# Altium schematic sheet Converter.SchDoc: Converter
size A3; DocumentNumber: 4; SheetNumber: 4; SheetTotal: 20
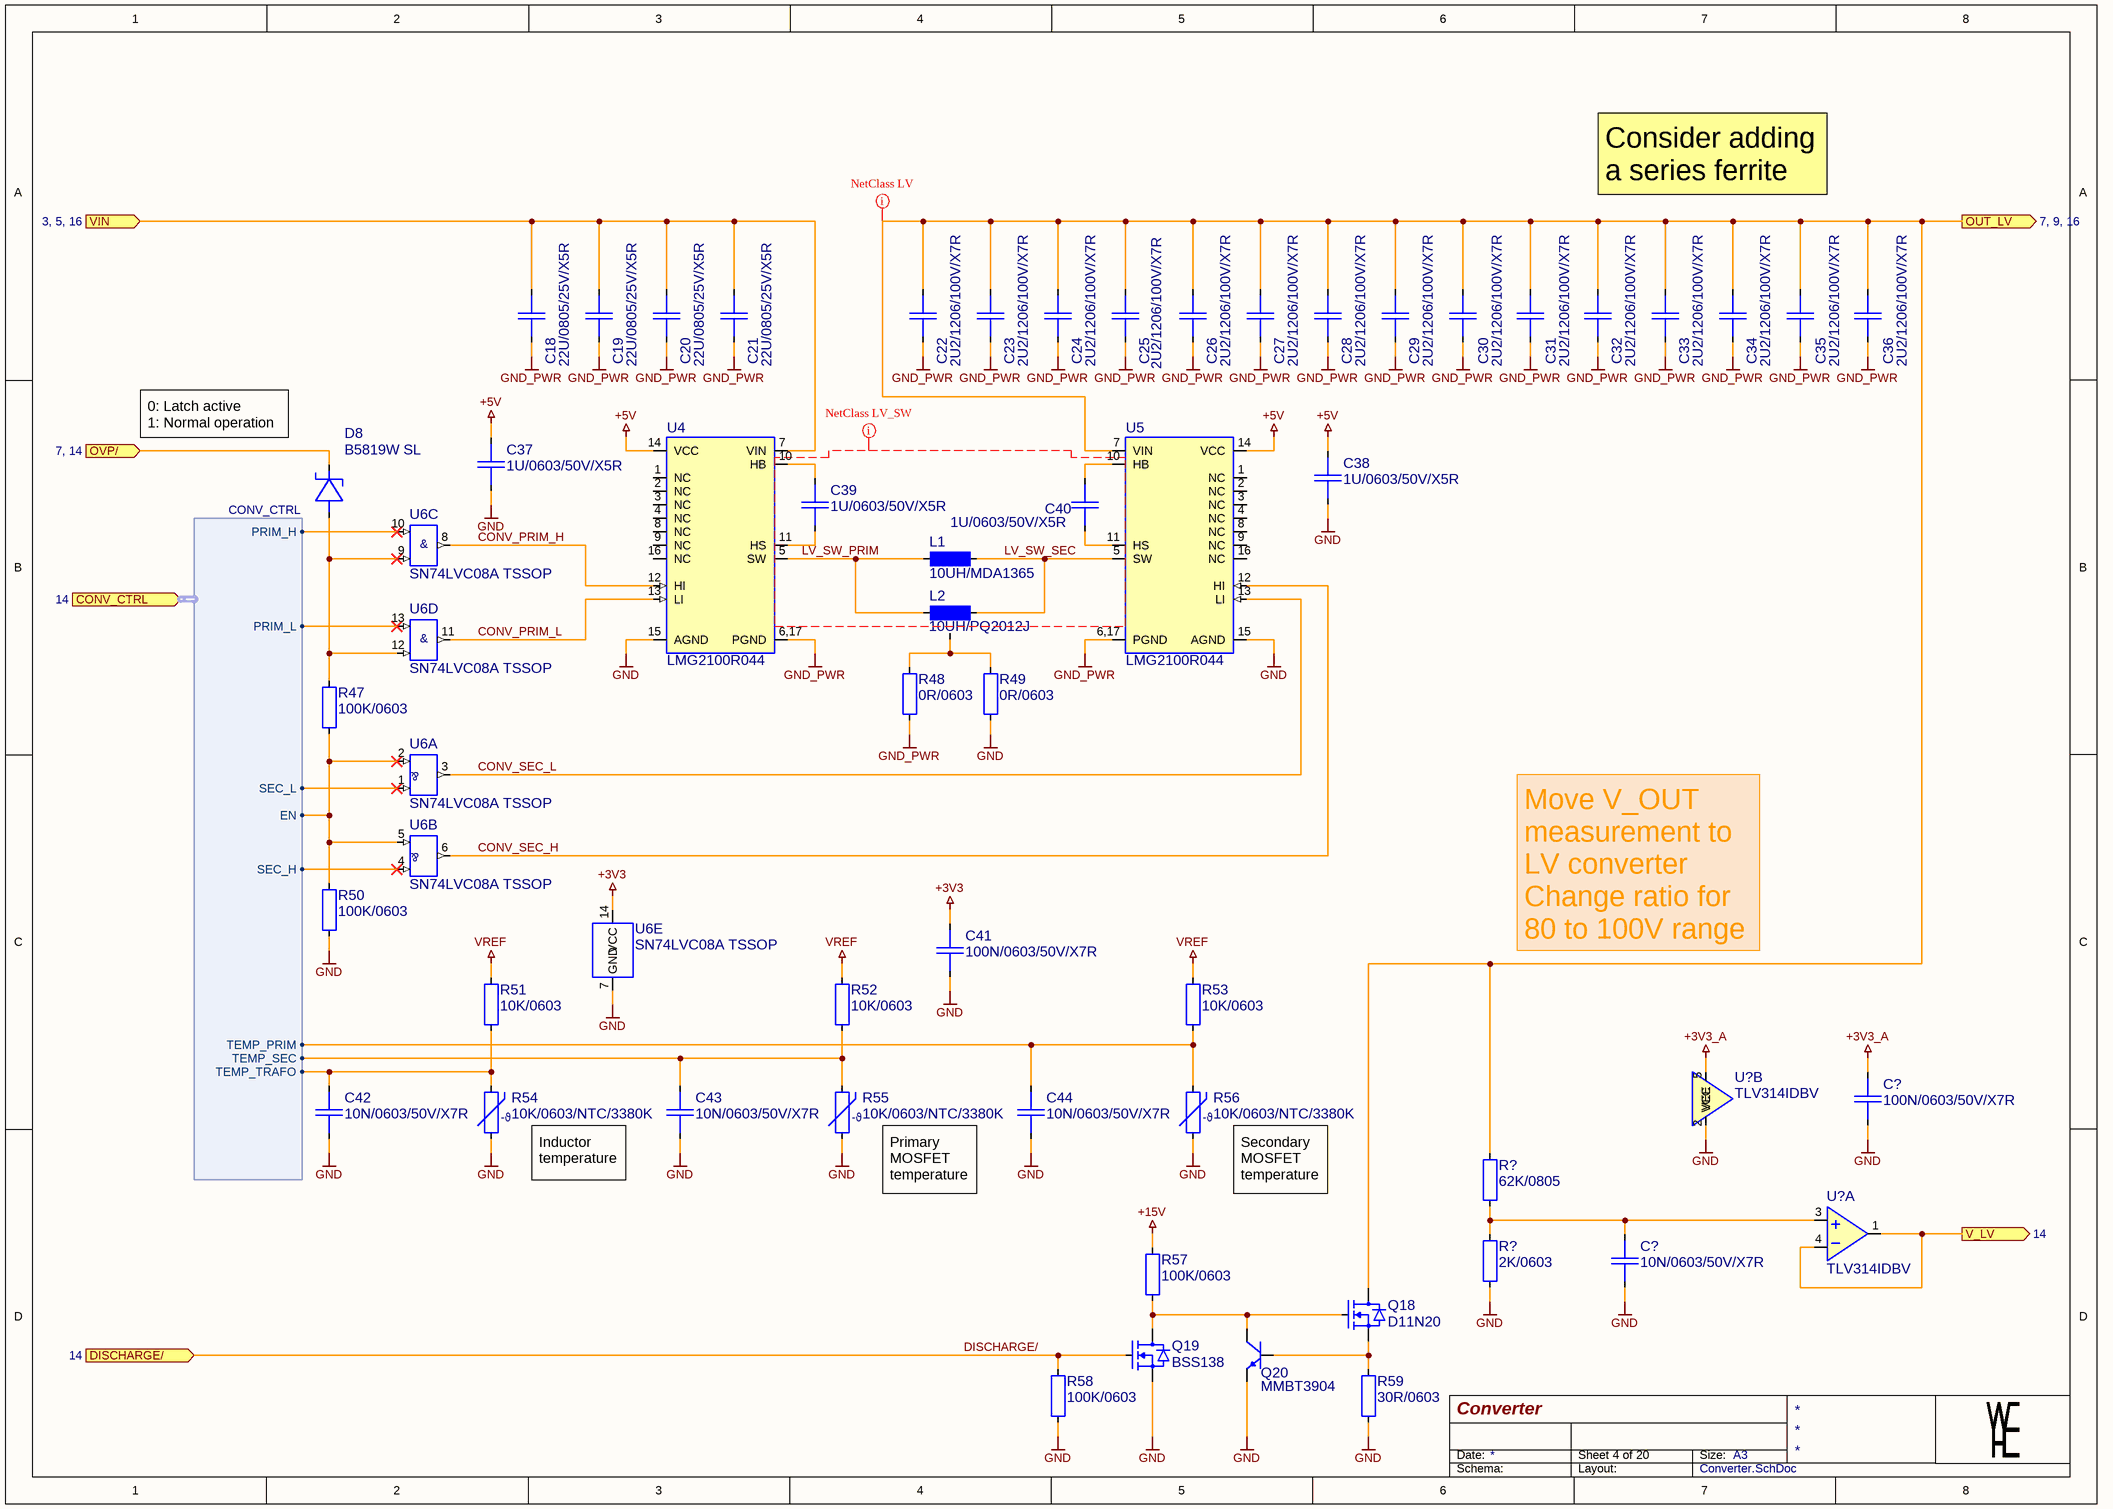
[diagram p0: Converter.SchDoc]

## Parts
(Parts that share a designator on the sheet are numbered #1, #2 ... from top to bottom, then left to right.)
C18  22U/0805/25V/X5R  [CAP0805_X7R]
C19  22U/0805/25V/X5R  [CAP0805_X7R]
C20  22U/0805/25V/X5R  [CAP0805_X7R]
C21  22U/0805/25V/X5R  [CAP0805_X7R]
C22  2U2/1206/100V/X7R  [CAP1206-X7R]
C23  2U2/1206/100V/X7R  [CAP1206-X7R]
C24  2U2/1206/100V/X7R  [CAP1206-X7R]
C25  2U2/1206/100V/X7R  [CAP1206-X7R]
C26  2U2/1206/100V/X7R  [CAP1206-X7R]
C27  2U2/1206/100V/X7R  [CAP1206-X7R]
C28  2U2/1206/100V/X7R  [CAP1206-X7R]
C29  2U2/1206/100V/X7R  [CAP1206-X7R]
C30  2U2/1206/100V/X7R  [CAP1206-X7R]
C31  2U2/1206/100V/X7R  [CAP1206-X7R]
C32  2U2/1206/100V/X7R  [CAP1206-X7R]
C33  2U2/1206/100V/X7R  [CAP1206-X7R]
C34  2U2/1206/100V/X7R  [CAP1206-X7R]
C35  2U2/1206/100V/X7R  [CAP1206-X7R]
C36  2U2/1206/100V/X7R  [CAP1206-X7R]
C37  1U/0603/50V/X5R  [CAP0603_X7R]
C38  1U/0603/50V/X5R  [CAP0603_X7R]
C39  1U/0603/50V/X5R  [CAP0603_X7R]
C40  1U/0603/50V/X5R  [CAP0603_X7R]
C41  100N/0603/50V/X7R  [CAP0603_X7R]
C42  10N/0603/50V/X7R  [CAP0603_X7R]
C43  10N/0603/50V/X7R  [CAP0603_X7R]
C44  10N/0603/50V/X7R  [CAP0603_X7R]
C?#1  100N/0603/50V/X7R  [CAP0603_X7R]
C?#2  10N/0603/50V/X7R  [CAP0603_X7R]
D8  B5819W SL  [SOD3718X125]
L1  10UH/MDA1365  [INDM140X128X65]
L2  10UH/PQ2012J  [IND_PQ2015J]
Q18  D11N20  [TO228P990X229-3]
Q19  BSS138  [SOT2395P280X125-3-SE]
Q20  MMBT3904  [SOT2395P280X125-3-SE]
R47  100K/0603  [R0603-0.40-WW]
R48  0R/0603  [R0603-0.40-WW]
R49  0R/0603  [R0603-0.40-WW]
R50  100K/0603  [R0603-0.40-WW]
R51  10K/0603  [R0603-0.40-WW]
R52  10K/0603  [R0603-0.40-WW]
R53  10K/0603  [R0603-0.40-WW]
R54  10K/0603/NTC/3380K  [R0603-0.40-WW]
R55  10K/0603/NTC/3380K  [R0603-0.40-WW]
R56  10K/0603/NTC/3380K  [R0603-0.40-WW]
R57  100K/0603  [R0603-0.40-WW]
R58  100K/0603  [R0603-0.40-WW]
R59  30R/0603  [R0603-0.40-WW]
R?#1  62K/0805  [R0805-0.50-WW]
R?#2  2K/0603  [R0603-0.40-WW]
U4  LMG2100R044  [QFN050P450X550X085-16-TI-VQFN-FCRLF]
U5  LMG2100R044  [QFN050P450X550X085-16-TI-VQFN-FCRLF]
U6  SN74LVC08A TSSOP  [SOP065P640X120-14NW]  (parts A,B,C,D,E of 5)
U?#1  TLV314IDBV  [SOT2395P280X125-5-NW]  (part B of 2)
U?#2  TLV314IDBV  [SOT2395P280X125-5-NW]  (part A of 2)

## Ports
CONV_CTRL (in, harness CONV_CTRL, see 14), DISCHARGE/ (in, see 14), OUT_LV (out, see 7, 9, 16), OVP/ (in, see 7, 14), V_LV (out, see 14), VIN (in, see 3, 5, 16)

## Harnesses
CONV_CTRL: EN, PRIM_L, SEC_L, PRIM_H, TEMP_PRIM, TEMP_SEC, TEMP_TRAFO, SEC_H

## Nets
+3V3: C41.1 U6.14(VCC)
+3V3_A: C?#1.1 U?#1.5(VCC)
+5V: C37.1 C38.1 U4.14(VCC) U5.14(VCC)
+15V: R57.1
GND: C37.2 C38.2 C41.2 C42.2 C43.2 C44.2 C?#1.2 C?#2.2 Q19.2(SOURCE) Q20.2(EMITTER) R49.2 R50.2 R54.2 R55.2 R56.2 R58.2 R59.2 R?#2.2 U4.15(AGND) U5.15(AGND) U6.7(GND) U?#1.2(VEE)
GND_PWR: C18.2 C19.2 C20.2 C21.2 C22.2 C23.2 C24.2 C25.2 C26.2 C27.2 C28.2 C29.2 C30.2 C31.2 C32.2 C33.2 C34.2 C35.2 C36.2 R48.2 U4.6,17(PGND) U5.6,17(PGND)
VREF: R51.1 R52.1 R53.1
CONV_PRIM_H: U4.12(HI) U6.8(Y2)
CONV_PRIM_L: U4.13(LI) U6.11(Y3)
CONV_SEC_H: U5.12(HI) U6.6(Y1)
CONV_SEC_L: U5.13(LI) U6.3(Y0)
DISCHARGE/: Q19.1(GATE) R58.1 ; port DISCHARGE/
LV_SW_PRIM: L1.1 L2.1 U4.5(SW)
LV_SW_SEC: L1.2 L2.2 U5.5(SW)
OUT_LV: C22.1 C23.1 C24.1 C25.1 C26.1 C27.1 C28.1 C29.1 C30.1 C31.1 C32.1 C33.1 C34.1 C35.1 C36.1 Q18.3(DRAIN) R?#1.1 U5.7(VIN) ; port OUT_LV
OVP/: D8.1(C) ; port OVP/
V_LV: U?#2.1(OUT) U?#2.4(IN-) ; port V_LV
VIN: C18.1 C19.1 C20.1 C21.1 U4.7(VIN) ; port VIN
NetC39_1: C39.1 U4.10(HB)
NetC39_2: C39.2 U4.11(HS)
NetC40_1: C40.1 U5.10(HB)
NetC40_2: C40.2 U5.11(HS)
NetC42_1: C42.1 R51.2 R54.1 ; port CONV_CTRL.TEMP_TRAFO
NetC43_1: C43.1 R52.2 R55.1 ; port CONV_CTRL.TEMP_SEC
NetC44_1: C44.1 R53.2 R56.1 ; port CONV_CTRL.TEMP_PRIM
NetC?#2_1: C?#2.1 R?#1.2 R?#2.1 U?#2.3(IN+)
NetD8_2: D8.2(A) R47.2 U6.9(B2) U6.12(B3)
NetL2_3: L2.3 R48.1 R49.1
NetQ18_1: Q18.1(GATE) Q19.3(DRAIN) Q20.3(COLLECTOR) R57.2
NetQ18_2: Q18.2(SOURCE) Q20.1(BASE) R59.1
NetR47_1: R47.1 R50.1 U6.2(B0) U6.5(B1) ; port CONV_CTRL.EN
NetU6_1: U6.1(A0) ; port CONV_CTRL.SEC_L
NetU6_4: U6.4(A1) ; port CONV_CTRL.SEC_H
NetU6_10: U6.10(A2) ; port CONV_CTRL.PRIM_H
NetU6_13: U6.13(A3) ; port CONV_CTRL.PRIM_L

Not connected (* = marked no-connect by the designer): U4 1(NC) 2(NC) 3(NC) 4(NC) 8(NC) 9(NC) 16(NC); U5 1(NC) 2(NC) 3(NC) 4(NC) 8(NC) 9(NC) 16(NC)

## Layout directives
net class LV: OUT_LV
net class LV_SW: LV_SW_PRIM, LV_SW_SEC

## Notes on the sheet
- Consider adding a series ferrite
- (near D8) 0: Latch active
  1: Normal operation
- Move V_OUT measurement to LV converter
  Change ratio for 80 to 100V range
- Inductor temperature
- Primary MOSFET temperature
- (near R56) Secondary MOSFET temperature
- (near R56) Alternative:
  G830K (C22362804)
- Date:
- Size:
- A3
- Schema:
- Layout:
- (in symbol 10K/0603/NTC/3380K) -ϑ
- (in symbol SN74LVC08A TSSOP, part A) &
- (in symbol SN74LVC08A TSSOP, part B) &
- (in symbol SN74LVC08A TSSOP, part C) &
- (in symbol SN74LVC08A TSSOP, part D) &

## Library data of the parts
C18-C21 = 22U/0805/25V/X5R: CAP SM 0805 22uF 25V X5R; Manufacturer: GENERIC; Manufacturer 1: Samsung Electro-Mechanics; Manufacturer Part Number 1: CL21A226MAYNNNE; Absolute Value: 2.2E-5; Eurocircuits GPN: GPN0805106-25; Part Number: 22U/0805/25V/X5R; Package: 0805; Value: 22uF; HelpURL: https://mm.digikey.com/Volume0/opasdata/d220001/medias/docus/339/CL21A226MAYNNNE_Spec.pdf; Supplier 1: Digi-Key; Supplier Part Number 1: 1276-CL21A226MAYNNNECT-ND; Manufacturer Part Number 3: CL21A226MAQNNNE; Supplier 3: LCSC; Supplier Part Number 3: C45783; JLC Type: Basic
C22-C36 = 2U2/1206/100V/X7R: CAP SM 1206 2.2uF 100V X7R; Manufacturer: GENERIC; Manufacturer 1: YAGEO; Manufacturer Part Number 1: CC1206KKX7R0BB225; Absolute Value: 2.2E-6; Part Number: 2U2/1206/100V/X7R; Package: 1206; Value: 2.2uF; HelpURL: https://www.yageogroup.com/content/datasheet/asset/file/UPY-GPHC_X7R_6_3V-TO-250V; Supplier 1: Digi-Key; Supplier Part Number 1: 311-3450-1-ND; Manufacturer Part Number 3: CC1206KKX7R0BB225; Supplier 3: LCSC; Supplier Part Number 3: C577211; JLC Type: Extended
C37-C40 = 1U/0603/50V/X5R: CAP SM 0603 1.0uF 50V X5R; Manufacturer: GENERIC; Manufacturer 1: Samsung Electro-Mechanics; Manufacturer Part Number 1: CL10A105KB8NNNC; Absolute Value: 1E-6; Eurocircuits GPN: GPC0603105-X5R; Part Number: 1U/0603/50V/X5R; Package: 0603; Value: 1.0uF; HelpURL: https://mm.digikey.com/Volume0/opasdata/d220001/medias/docus/658/CL10A105KB8NNNC_Spec.pdf; Supplier 1: Digi-Key; Supplier Part Number 1: 1276-1860-1-ND; Supplier 3: LCSC; Supplier Part Number 3: C15849; JLC Type: Basic; Manufacturer Part Number 3: CL10A105KB8NNNC
C41 C?#1 = 100N/0603/50V/X7R: CAP SM 0603 100nF 50V X7R; Manufacturer: GENERIC; Manufacturer 1: YAGEO; Manufacturer Part Number 1: CC0603KPX7R9BB104; Absolute Value: 1E-7; Eurocircuits GPN: GPC0603104; Part Number: 100N/0603/50V/X7R; Package: 0603; Value: 100nF; HelpURL: https://www.yageo.com/upload/media/product/app/datasheet/mlcc/upy-gphc_x7r_6_3v-to-250v.pdf; Supplier 1: Digi-Key; Supplier Part Number 1: 311-3567-1-ND; Supplier 3: LCSC; Supplier Part Number 3: C14663; Manufacturer 2: YAGEO; Manufacturer Part Number 2: CC0603MRX7R9BB104; Supplier 2: Digi-Key; Supplier Part Number 2: 311-4110-1-ND; JLC Type: Basic; Manufacturer Part Number 3: CC0603KRX7R9BB104
C42-C44 C?#2 = 10N/0603/50V/X7R: CAP SM 0603 10nF 50V X7R; Manufacturer: GENERIC; Manufacturer 1: YAGEO; Manufacturer Part Number 1: CC0603KPX7R9BB103; Absolute Value: 1E-8; Eurocircuits GPN: GPC0603103; Part Number: 10N/0603/50V/X7R; Package: 0603; Value: 10nF; HelpURL: https://www.yageo.com/upload/media/product/app/datasheet/mlcc/upy-gphc_x7r_6_3v-to-250v.pdf; Supplier 1: Digi-Key; Supplier Part Number 1: 311-1572-1-ND; Manufacturer 2: YAGEO; Manufacturer Part Number 2: CC0603KRX7R9BB103; Supplier 2: Digi-Key; Supplier Part Number 2: 311-1085-1-ND; Manufacturer Part Number 3: CC0603KRX7R9BB103; Supplier 3: LCSC; Supplier Part Number 3: C100042
D8 = B5819W SL: 40V 600mV@1A 1A SOD-123 Schottky Barrier Diodes; Manufacturer: GENERIC; Manufacturer 1: SMC Diode Solutions; Part Number: B5819W SL; Package: SOD-123; Value: B5819W SL; Absolute Value: 40V; HelpURL: https://datasheet.lcsc.com/lcsc/2304140030_Jiangsu-Changjing-Electronics-Technology-Co---Ltd--B5819W-SL_C8598.pdf; Manufacturer Part Number 1: B5819WSL; Supplier 1: Digikey; Supplier Part Number 1: 1655-B5819WSLCT-ND; Manufacturer 3: Jiangsu Changjing Electronics Technology Co., Ltd.; Manufacturer Part Number 3: B5819W SL; Supplier 3: LCSC; Supplier Part Number 3: C8598; JLC Type: Basic
L1 = 10UH/MDA1365: Fixed Ind 10uH 11A 15.8mOhm SMD MDA1365; Manufacturer: Koherelec; Absolute Value: 1E-5; Part Number: 10UH/MDA1365; Package: 1365; Value: 10UH; HelpURL: http://www.kohergroup.com/template/default/pdf/MDA1365.pdf; Manufacturer 3: KOHERelec; Manufacturer Part Number 3: MDA1365-100M; Supplier 3: LCSC; Supplier Part Number 3: C2847583; JLC Type: Extended
L2 = 10UH/PQ2012J: Fixed Ind 10uH 14A 4.8mOhm SMD; Manufacturer: XR; Absolute Value: 1E-5; Part Number: 10UH/PQ2012J; Package: PQ2012J; Value: 10UH; HelpURL: https://www.lcsc.com/datasheet/C48391639.pdf; Manufacturer 3: XR; Manufacturer Part Number 3: XRPQ2012J-100M; Supplier 3: LCSC; Supplier Part Number 3: C48391639; JLC Type: Extended
Q18 = D11N20: N-Channel MOSFET 200V 11A; Manufacturer: Jingdao Microelectronics; Part Number: D11N20; Package: TO-252AA; HelpURL: https://www.lcsc.com/datasheet/C2935478.pdf; Manufacturer 3: Jingdao Microelectronics; Manufacturer Part Number 3: D11N20; Supplier 3: LCSC; Supplier Part Number 3: C2935478; JLC Type: Extended
Q19 = BSS138: N-Kanal 50 V 220mA (Ta) 350mW (Ta) Oberflächenmontage SOT-23; Manufacturer: GENERIC; Manufacturer 1: ANBON SEMICONDUCTOR (INT'L) LIMITED; Part Number: BSS138; Package: SOT23; HelpURL: https://mm.digikey.com/Volume0/opasdata/d220001/medias/docus/3037/BSS138.pdf; Manufacturer Part Number 1: BSS138; Supplier 1: Digi-Key; Supplier Part Number 1: 4530-BSS138CT-ND; Manufacturer 3: FOSAN; Manufacturer Part Number 3: BSS138; Supplier 3: LCSC; Supplier Part Number 3: C2926186; JLC Type: Extended; Manufacturer 2: FOSAN; Manufacturer Part Number 2: BSS138; Supplier 2: LCSC; Supplier Part Number 2: C2926186
Q20 = MMBT3904: MMBT3904 40V, 0.2A NPN BJT transistor; Manufacturer: GENERIC; Manufacturer 1: onsemi; Manufacturer Part Number 1: MMBT3904LT1G; Part Number: MMBT3904; Package: SOT23; HelpURL: https://onsemi.com/pdf/datasheet/mmbt3904lt1-d.pdf; Manufacturer 3: JSCJ; Manufacturer Part Number 3: MMBT3904(RANGE:100-300); Supplier 3: LCSC; Supplier Part Number 3: C20526; Supplier 1: Digi-Key; Supplier Part Number 1: MMBT3904LT1GOSCT-ND; Manufacturer 2: MCC (Micro Commercial Components); Manufacturer Part Number 2: MMBT3904-TP; Supplier 2: Digikey; Supplier Part Number 2: MMBT3904TPMSCT-ND; JLC Type: Basic
R47 R50 R57 R58 = 100K/0603: RES SM 0603 100K; Manufacturer: GENERIC; Manufacturer 1: YAGEO; Manufacturer Part Number 1: RC0603FR-13100KL; Absolute Value: 100000; Eurocircuits GPN: GPR0603100K; Part Number: 100K/0603; Package: 0603; Value: 100K; HelpURL: https://www.yageogroup.com/content/datasheet/asset/file/PYU-RC_GROUP_51_ROHS_L; Supplier 1: Digi-Key; Supplier Part Number 1: 13-RC0603FR-13100KLCT-ND; Manufacturer 2: YAGEO; Manufacturer Part Number 2: RC0603FR-10100KL; Supplier 2: Digi-Key; Supplier Part Number 2: 13-RC0603FR-10100KLCT-ND; Manufacturer 3: UNI-ROYAL(Uniroyal Elec); Manufacturer Part Number 3: 0603WAF1003T5E; Supplier 3: LCSC; Supplier Part Number 3: C25803; JLC Type: Basic
R48 R49 = 0R/0603: RES SM 0603 0R; Manufacturer: GENERIC; Manufacturer 1: YAGEO; Manufacturer Part Number 1: RC0603FR-070RL; Absolute Value: 0; Eurocircuits GPN: GPR06030R; Part Number: 0R/0603; Package: 0603; Value: 0R; HelpURL: https://www.yageogroup.com/content/datasheet/asset/file/PYU-RC_GROUP_51_ROHS_L; Supplier 1: Digi-Key; Supplier Part Number 1: 311-0.0HRCT-ND; Manufacturer 2: YAGEO; Manufacturer Part Number 2: RC0603FR-130RL; Supplier 2: Digi-Key; Supplier Part Number 2: 13-RC0603FR-130RLCT-ND; Manufacturer 3: UNI-ROYAL(Uniroyal Elec); Manufacturer Part Number 3: 0603WAF0000T5E; Supplier 3: LCSC; Supplier Part Number 3: C21189; JLC Type: Basic
R51-R53 = 10K/0603: RES SM 0603 10K; Manufacturer: GENERIC; Manufacturer 1: YAGEO; Manufacturer Part Number 1: RC0603FR-1310KL; Absolute Value: 10000; Eurocircuits GPN: GPR060310K; Part Number: 10K/0603; Package: 0603; Value: 10K; HelpURL: https://www.yageogroup.com/content/datasheet/asset/file/PYU-RC_GROUP_51_ROHS_L; Supplier 1: Digi-Key; Supplier Part Number 1: 13-RC0603FR-1310KLCT-ND; Manufacturer 2: YAGEO; Manufacturer Part Number 2: RC0603FR-1010KL; Supplier 2: Digi-Key; Supplier Part Number 2: 13-RC0603FR-1010KLCT-ND; Manufacturer 3: UNI-ROYAL(Uniroyal Elec); Manufacturer Part Number 3: 0603WAF1002T5E; Supplier 3: LCSC; Supplier Part Number 3: C25804; JLC Type: Basic
R54-R56 = 10K/0603/NTC/3380K: RES NTC SM 0603 10K; Manufacturer: GENERIC; Manufacturer 1: Murata; Manufacturer Part Number 1: NCU18XH103E60RB; Absolute Value: 10000; Eurocircuits GPN: GPR060310K; Part Number: 10K/0603/NTC/3380K; Package: 0603; Value: 10K; HelpURL: https://www.murata.com/en-us/api/pdfdownloadapi?cate=luNTCforTempeSenso&partno=NCU18XH103E60RB; Supplier 1: Digi-Key; Supplier Part Number 1: 490-18164-1-ND; Manufacturer 3: Sunlord; Manufacturer Part Number 3: SDNT1608X103F3380FTF; Supplier 3: LCSC; Supplier Part Number 3: C316397; JLC Type: Extended
R59 = 30R/0603: RES SM 0603 30R; Manufacturer: GENERIC; Manufacturer 1: YAGEO; Manufacturer Part Number 1: RC0603FR-1330RL; Absolute Value: 30; Eurocircuits GPN: GPR060330R; Part Number: 30R/0603; Package: 0603; Value: 30R; HelpURL: https://www.yageogroup.com/content/datasheet/asset/file/PYU-RC_GROUP_51_ROHS_L; Supplier 1: Digi-Key; Supplier Part Number 1: 13-RC0603FR-1330RLCT-ND; Manufacturer 2: YAGEO; Manufacturer Part Number 2: RC0603FR-0730RL; Supplier 2: Digi-Key; Supplier Part Number 2: 311-30.0HRCT-ND; JLC Type: Extended; Manufacturer 3: YAGEO; Manufacturer Part Number 3: RC0603FR-0730RL; Supplier 3: LCSC; Supplier Part Number 3: C128060
R?#1 = 62K/0805: RES SM 0805 62K; Manufacturer: GENERIC; Manufacturer 1: YAGEO; Manufacturer Part Number 1: RC0805FR-0762KL; Absolute Value: 62000; Eurocircuits GPN: GPR080562K; Part Number: 62K/0805; Package: 0805; Value: 62K; HelpURL: https://www.yageogroup.com/content/datasheet/asset/file/PYU-RC_GROUP_51_ROHS_L; Supplier 1: Digi-Key; Supplier Part Number 1: 311-62.0KCRCT-ND
R?#2 = 2K/0603: RES SM 0603 2K; Manufacturer: GENERIC; Manufacturer 1: YAGEO; Manufacturer Part Number 1: RC0603FR-132KL; Absolute Value: 2000; Eurocircuits GPN: GPR06032K; Part Number: 2K/0603; Package: 0603; Value: 2K; HelpURL: https://www.yageogroup.com/content/datasheet/asset/file/PYU-RC_GROUP_51_ROHS_L; Supplier 1: Digi-Key; Supplier Part Number 1: 13-RC0603FR-132KLCT-ND; JLC Type: Basic; Manufacturer 3: UNI-ROYAL(Uniroyal Elec); Manufacturer Part Number 3: 0603WAF2001T5E; Supplier 3: LCSC; Supplier Part Number 3: C22975; Manufacturer 2: YAGEO; Manufacturer Part Number 2: RC0603FR-102KL; Supplier 2: Digi-Key; Supplier Part Number 2: 13-RC0603FR-102KLCT-ND
U4 U5 = LMG2100R044: LMG2100R044 100V, 35A GaN Half-Bridge Power Stage; Manufacturer: Texas Instruments; Manufacturer Part Number 1: LMG2100R044RARR; Part Number: LMG2100R044; Package: QFN-17; HelpURL: https://www.ti.com/lit/ds/symlink/lmg2100r044.pdf; Manufacturer 1: Texas Instruments; Supplier 1: Digi-Key; Supplier Part Number 1: 296-LMG2100R044RARRCT-ND; Manufacturer 3: TI; Manufacturer Part Number 3: LMG2100R044RARR; Supplier 3: LCSC; Supplier Part Number 3: C22453052; JLC Type: Extended
U6 = SN74LVC08A TSSOP: SN74LVC08A Quadruple 2-Input Positive-AND Gates; Manufacturer: TI; Manufacturer 1: Texas Instruments; Manufacturer Part Number 1: SN74LVC08APWR; Part Number: SN74LVC08A TSSOP; Package: TSSOP; Manufacturer 3: TI; Manufacturer Part Number 3: SN74LVC08APWR; Supplier 3: LCSC; Supplier Part Number 3: C465737; JLC Type: Extended; HelpURL: https://www.ti.com/lit/ds/symlink/sn74lvc08a.pdf; Supplier 1: Digi-Key; Supplier Part Number 1: 296-1221-1-ND
U?#1 U?#2 = TLV314 SOT23: TLV314, 3-MHz, Low-Power, Internal EMI Filter, RRIO, Operational Amplifier; Manufacturer: Texas Instruments; Manufacturer Part Number 1: TLV314IDBVR; Part Number: TLV314 SOT23; Package: SOT23-5; HelpURL: https://www.ti.com/lit/ds/symlink/tlv4314.pdf; Manufacturer 1: Texas Instruments; Supplier 1: Digi-Key; Supplier Part Number 1: 296-46275-1-ND; Manufacturer 3: Texas Instruments; Manufacturer Part Number 3: TLV314IDBVR; Supplier 3: LCSC; Supplier Part Number 3: C133032; Manufacturer 2: Texas Instruments; Manufacturer Part Number 2: TLV314IDBVT; Supplier 2: Digi-Key; Supplier Part Number 2: 296-44110-2-ND